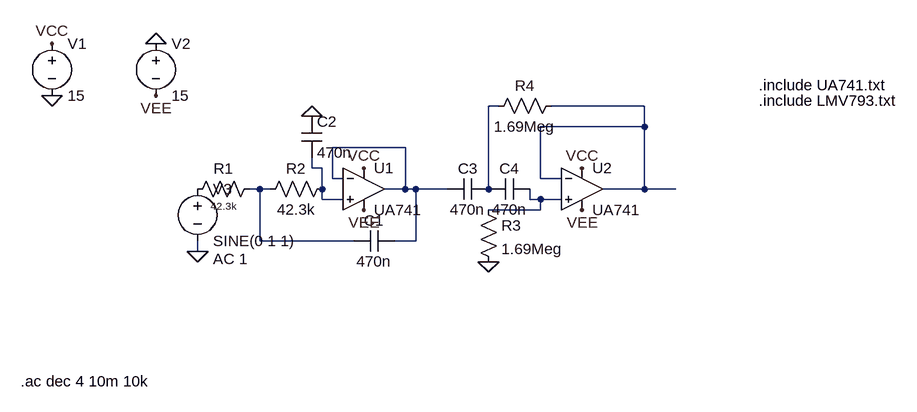
[diagram p0: schematic 2ndOrderButterworth.asc]
2ndOrderButterworth.asc, the LTspice schematic file:
Version 4
SHEET 1 884 680
WIRE 240 -144 224 -144
WIRE 464 -144 320 -144
WIRE 464 -112 464 -144
WIRE 464 -112 304 -112
WIRE 96 -80 -16 -80
WIRE -48 -48 -48 -64
WIRE -32 -48 -48 -48
WIRE -16 -32 -16 -80
WIRE 0 -32 -16 -32
WIRE 304 -32 304 -112
WIRE 336 -32 304 -32
WIRE -128 -16 -144 -16
WIRE -112 -16 -128 -16
WIRE -32 -16 -32 -48
WIRE 96 -16 96 -80
WIRE 96 -16 64 -16
WIRE 112 -16 96 -16
WIRE 160 -16 112 -16
WIRE 224 -16 224 -144
WIRE 464 -16 464 -112
WIRE 464 -16 400 -16
WIRE 512 -16 464 -16
WIRE -32 0 -32 -16
WIRE 0 0 -32 0
WIRE 288 0 288 -16
WIRE 304 0 288 0
WIRE 336 0 304 0
WIRE 304 16 304 0
WIRE 304 16 224 16
WIRE -128 64 -128 -16
WIRE 16 64 -128 64
WIRE 112 64 112 -16
WIRE 112 64 80 64
WIRE -224 80 -224 64
FLAG -448 -240 VCC
FLAG -288 -160 VEE
FLAG -448 -160 0
FLAG -288 -240 0
FLAG 32 -48 VCC
FLAG 32 16 VEE
FLAG -48 -128 0
FLAG -224 80 0
FLAG 224 96 0
FLAG 368 -48 VCC
FLAG 368 16 VEE
SYMBOL voltage -448 -256 R0
WINDOW 123 0 0 Left 0
WINDOW 39 0 0 Left 0
SYMATTR InstName V1
SYMATTR Value 15
SYMBOL voltage -288 -256 R0
WINDOW 123 0 0 Left 0
WINDOW 39 0 0 Left 0
SYMATTR InstName V2
SYMATTR Value 15
SYMBOL Opamps\\opamp2 32 -80 R0
SYMATTR InstName U1
SYMATTR Value UA741
SYMBOL res -128 -32 R90
WINDOW 0 0 56 VBottom 2
WINDOW 3 32 56 VTop 1
SYMATTR InstName R1
SYMATTR Value 42.3k
SYMBOL res -16 -32 R90
WINDOW 0 0 56 VBottom 2
WINDOW 3 32 56 VTop 2
SYMATTR InstName R2
SYMATTR Value 42.3k
SYMBOL cap 80 48 R90
WINDOW 0 0 32 VBottom 2
WINDOW 3 32 32 VTop 2
SYMATTR InstName C1
SYMATTR Value 470n
SYMBOL cap -64 -128 R0
SYMATTR InstName C2
SYMATTR Value 470n
SYMBOL voltage -224 -32 R0
WINDOW 123 24 124 Left 2
WINDOW 39 0 0 Left 0
SYMATTR Value2 AC 1
SYMATTR InstName V3
SYMATTR Value SINE(0 1 1)
SYMBOL Opamps\\opamp2 368 -80 R0
SYMATTR InstName U2
SYMATTR Value UA741
SYMBOL cap 224 -32 R90
WINDOW 0 0 32 VBottom 2
WINDOW 3 32 32 VTop 2
SYMATTR InstName C3
SYMATTR Value 470n
SYMBOL cap 288 -32 R90
WINDOW 0 0 32 VBottom 2
WINDOW 3 32 32 VTop 2
SYMATTR InstName C4
SYMATTR Value 470n
SYMBOL res 208 0 R0
SYMATTR InstName R3
SYMATTR Value 1.69Meg
SYMBOL res 336 -160 R90
WINDOW 0 0 56 VBottom 2
WINDOW 3 32 56 VTop 2
SYMATTR InstName R4
SYMATTR Value 1.69Meg
TEXT 640 -176 Left 2 !.include UA741.txt
TEXT 640 -152 Left 2 !.include LMV793.txt
TEXT -496 280 Left 2 !.ac dec 4 10m 10k

The netlist it stands for:
* 2ndOrderButterworth.asc
V1 VCC 0 15
V2 0 VEE 15
XU1 N004 N003 VCC VEE N003 UA741  ; pins In+ In- V+ V- OUT
R1 N005 P001 42.3k
R2 N004 N005 42.3k
C1 N003 N005 470n
C2 0 N004 470n
V3 P001 0 SINE(0 1 1) AC 1
XU2 N006 N002 VCC VEE N002 UA741  ; pins In+ In- V+ V- OUT
C3 N001 N003 470n
C4 N006 N001 470n
R3 N006 0 1.69Meg
R4 N002 N001 1.69Meg
.include UA741.txt
.include LMV793.txt
.ac dec 4 10m 10k
.backanno
.end